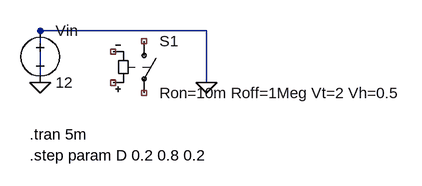
[diagram p0: schematic buck_step.asc]
buck_step.asc, the LTspice schematic file:
Version 4
SHEET 1 880 680
WIRE 128 96 64 96
WIRE 224 96 128 96
WIRE 320 96 224 96
WIRE 320 176 320 96
WIRE 64 176 64 96
FLAG 64 176 0
FLAG 320 176 0
SYMBOL voltage 64 80 R0
SYMATTR InstName Vin
SYMATTR Value 12
SYMBOL sw 224 96 R0
SYMATTR InstName S1
SYMATTR Value Ron=10m Roff=1Meg Vt=2 Vh=0.5
TEXT 48 256 Left 2 !.tran 5m
TEXT 48 288 Left 2 !.step param D 0.2 0.8 0.2

The netlist it stands for:
* buck_step.asc
Vin 0 0 12
S1 NC_01 NC_02 NC_03 NC_04 Ron=10m Roff=1Meg Vt=2 Vh=0.5
.tran 5m
.step param D 0.2 0.8 0.2
.backanno
.end